# Altium schematic sheet A3.3V.SchDoc
size A4; SheetNumber: 8; SheetTotal: 8
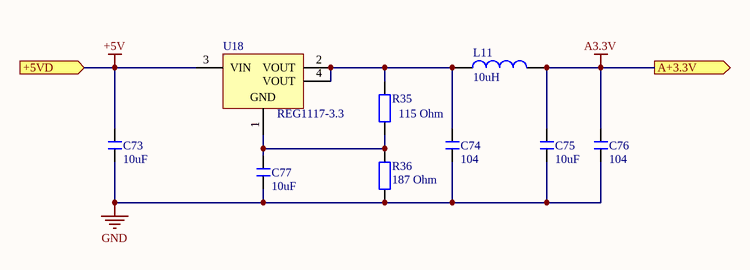
[diagram p0: A3.3V.SchDoc]

## Parts
C73  10uF  [C 0805_L]
C74  104  [C 0805_L]
C75  10uF  [C 0805_L]
C76  104  [C 0805_L]
C77  10uF  [C 0805_L]
L11  10uH  [AL0307]
R35  115 Ohm  [R 0805_L]
R36  187 Ohm  [R 0805_L]
U18  REG1117-3.3  [DCY0004A_M]

## Ports
+5VD (in, see DC_SUPPLY[2C], 1.5V[2B], 1.8V[1A], 1V[2A], 3.3V[2C], 5VD_and_5VDC_and_12V[3B], VTTVREF[2B]), A+3.3V (out, see DC_SUPPLY[2C])

## Nets
+5V: C73.2 U18.3(VIN) ; port +5VD
A3.3V: C75.2 C76.2 L11.2 ; port A+3.3V
GND: C73.1 C74.1 C75.1 C76.1 C77.1 R36.1
NetC74_2: C74.2 L11.1 R35.2 U18.2(VOUT) U18.4(VOUT)
NetC77_2: C77.2 R35.1 R36.2 U18.1(GND)

## Library data of the parts
C73-C77 = C: 贴片电容; BOM名称: 无极性贴片电容; 淘宝ID: 封装库来自淘宝 ID：黄晶宝石; 联系售后，技术支持: https://shop463601444.taobao.com; 唯一出售店铺网址: https://shop463601444.taobao.com
L11 = L-AL: 色环电感; 淘宝ID: 封装库来自淘宝 ID：黄晶宝石; BOM名称: 色环电感; 学习资源: https://shop463601444.taobao.com
R35 R36 = R: 贴片电阻; 版权归属: 来自淘宝 ID：黄晶宝石; 封装库来自淘宝卖家 ID：黄晶宝石: 其他店铺购入均为盗版，不享受售后技术支持服务，请立即申请退款; BOM名称: 贴片电阻; 联系售后: https://shop463601444.taobao.com
U18 = CMP-0395-00549-2: Single Output LDO, 800 mA, Fixed 3.3 V Output, 3.8 to 15 V Input, with Internal Current Limiting, 4-pin SOT-223 (DCY), -40 to 125 degC, Green (RoHS & no Sb/Br); Manufacturer: Texas Instruments; Vout Adj(Max)(V): 3.3; Vin(Max)(V): 15; Iq(Typ)(mA): 4; Iout(Max)(A): 0.8; Vdo(Typ)(mV): 1100; Vin(Min)(V): 3.8; SubFamily: Single Channel LDO; Rating: Catalog; Fixed Output Options(V): 5; ComponentLink1Description: Manufacturer URL; Eco-Plan: Green (RoHS & no Sb/Br); PackageReference: DCY0004A; Mounting Technology: Surface Mount; ComponentLink3Description: Package Specification; Vout Adj(Min)(V): 3.3; ComponentLink2URL: http://www.ti.com/general/docs/lit/getliterature.tsp?genericPartNumber=REG1117-33&fileType=pdf; PackageVersion: 4202506/B; ComponentLink3URL: http://www.ti.com/litv/pdf/mpds094a; Code_JEDEC: TO-261; ComponentLink1URL: http://www.ti.com/; ComponentLink2Description: Datasheet; PartNumber: REG1117-3.3; DatasheetVersion: SBVS001D; PackageDescription: 4-Pin Plastic Small Outline, Body 3.5 x 6.5 mm, Pitch 2.3 mm